# Altium project 4in1_ESC.PrjPcb
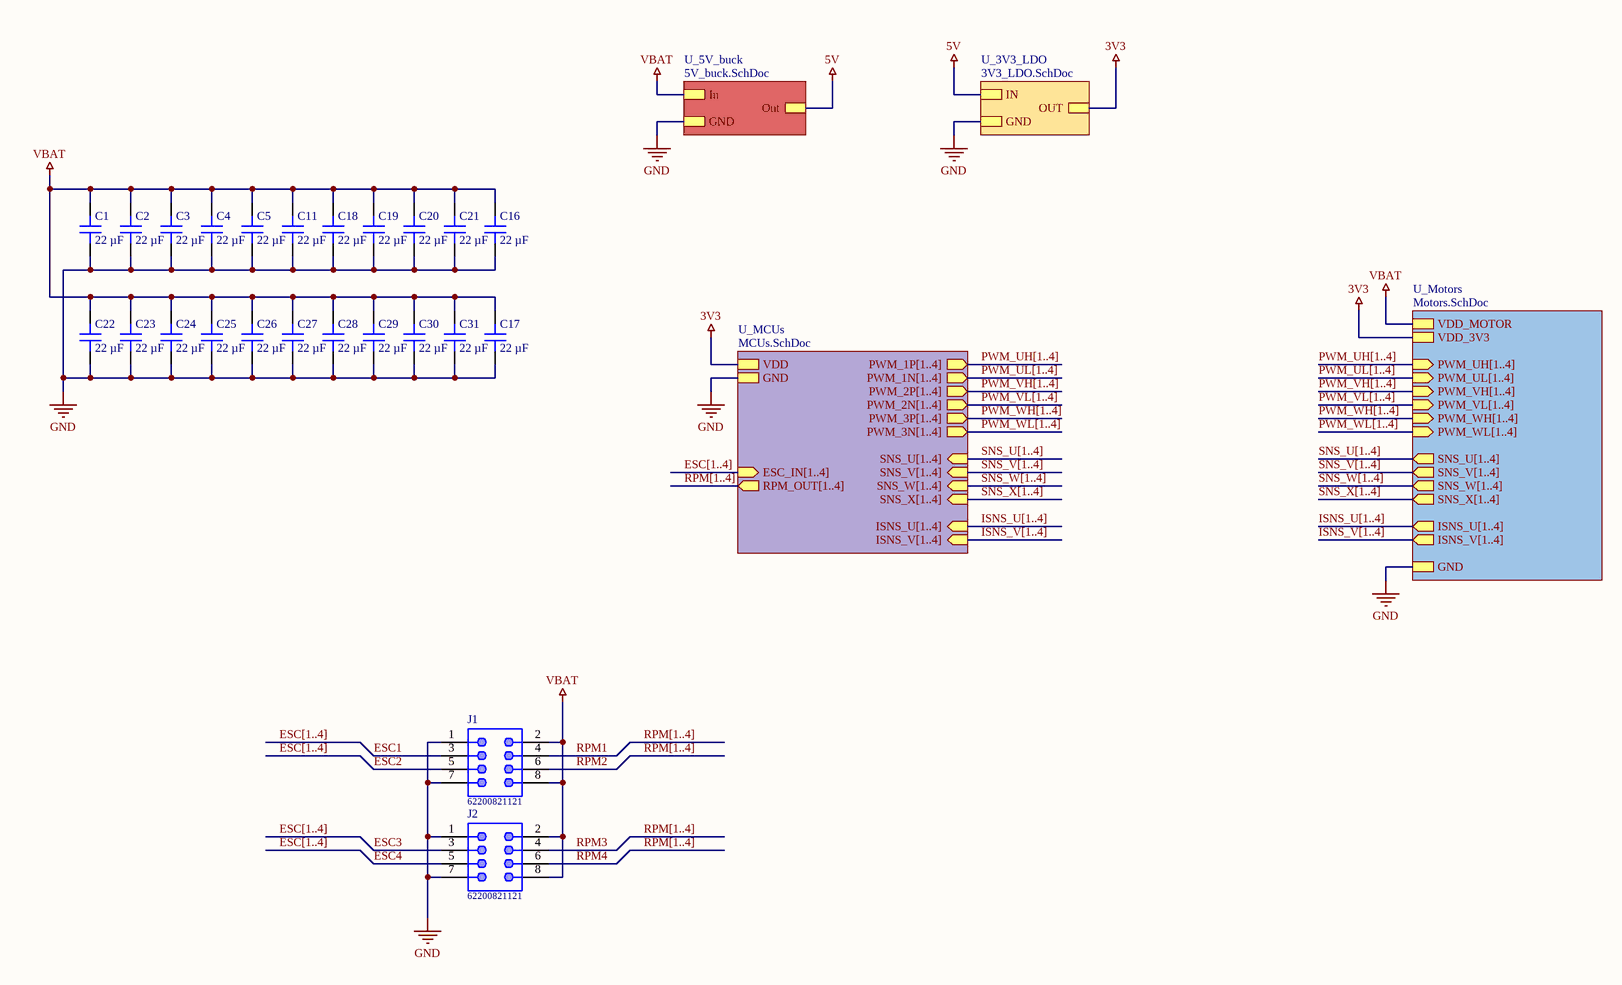
[diagram p0: Top.SchDoc]
7 sheets, 177 parts. Net scope: strictly hierarchical (ports join the sheet entries above them; power ports are local).
Board file: 4in1_ESC.PcbDoc
Sheets:
  Top.SchDoc
    U_5V_buck = 5V_buck.SchDoc
    U_3V3_LDO = 3V3_LDO.SchDoc
    U_Motors = Motors.SchDoc
      U_MOSFETs1 = MOSFETs.SchDoc
      U_MOSFETs2 = MOSFETs.SchDoc
      U_MOSFETs3 = MOSFETs.SchDoc
      U_MOSFETs4 = MOSFETs.SchDoc
      U_Half Bridge Driver_1 = Half_Bridge_Driver.SchDoc
      U_Half Bridge Driver_2 = Half_Bridge_Driver.SchDoc
      U_Half Bridge Driver_3 = Half_Bridge_Driver.SchDoc
      U_Half Bridge Driver_4 = Half_Bridge_Driver.SchDoc
    U_MCUs = MCUs.SchDoc

## Sheet Top.SchDoc
size B; SheetNumber: 1; SheetTotal: 8

### Parts
C1  22 µF  [CAP 0805_2012]
C2  22 µF  [CAP 0805_2012]
C3  22 µF  [CAP 0805_2012]
C4  22 µF  [CAP 0805_2012]
C5  22 µF  [CAP 0805_2012]
C11  22 µF  [CAP 0805_2012]
C16  22 µF  [CAP 0805_2012]
C17  22 µF  [CAP 0805_2012]
C18  22 µF  [CAP 0805_2012]
C19  22 µF  [CAP 0805_2012]
C20  22 µF  [CAP 0805_2012]
C21  22 µF  [CAP 0805_2012]
C22  22 µF  [CAP 0805_2012]
C23  22 µF  [CAP 0805_2012]
C24  22 µF  [CAP 0805_2012]
C25  22 µF  [CAP 0805_2012]
C26  22 µF  [CAP 0805_2012]
C27  22 µF  [CAP 0805_2012]
C28  22 µF  [CAP 0805_2012]
C29  22 µF  [CAP 0805_2012]
C30  22 µF  [CAP 0805_2012]
C31  22 µF  [CAP 0805_2012]
J1  62200821121  [62200821121]
J2  62200821121  [62200821121]

### Sub-sheets
U_3V3_LDO = 3V3_LDO.SchDoc: OUT, IN, GND
U_5V_buck = 5V_buck.SchDoc: Out, In, GND
U_MCUs = MCUs.SchDoc: VDD, GND, PWM_1P[1..4] (out), PWM_1N[1..4] (out), PWM_2P[1..4] (out), PWM_2N[1..4] (out), PWM_3P[1..4] (out), PWM_3N[1..4] (out), SNS_U[1..4] (in), SNS_V[1..4] (in), SNS_W[1..4] (in), SNS_X[1..4] (in), ISNS_U[1..4] (in), ISNS_V[1..4] (in), ESC_IN[1..4] (in), RPM_OUT[1..4] (out)
U_Motors = Motors.SchDoc: VDD_MOTOR, GND, PWM_UH[1..4] (in), PWM_UL[1..4] (in), PWM_VH[1..4] (in), PWM_VL[1..4] (in), PWM_WH[1..4] (in), PWM_WL[1..4] (in), SNS_U[1..4] (out), SNS_V[1..4] (out), SNS_W[1..4] (out), SNS_X[1..4] (out), VDD_3V3, ISNS_U[1..4] (out), ISNS_V[1..4] (out)

### Nets
3V3: sheet U_3V3_LDO/OUT, sheet U_Motors/VDD_3V3, sheet U_MCUs/VDD
5V: sheet U_5V_buck/Out, sheet U_3V3_LDO/IN
GND: C1.1 C2.1 C3.1 C4.1 C5.1 C11.1 C16.1 C17.1 C18.1 C19.1 C20.1 C21.1 C22.1 C23.1 C24.1 C25.1 C26.1 C27.1 C28.1 C29.1 C30.1 C31.1 J1.1 J1.7 J2.1 J2.7 ; sheet U_5V_buck/GND, sheet U_3V3_LDO/GND, sheet U_Motors/GND, sheet U_MCUs/GND
VBAT: C1.2 C2.2 C3.2 C4.2 C5.2 C11.2 C16.2 C17.2 C18.2 C19.2 C20.2 C21.2 C22.2 C23.2 C24.2 C25.2 C26.2 C27.2 C28.2 C29.2 C30.2 C31.2 J1.2 J1.8 J2.2 J2.8 ; sheet U_5V_buck/In, sheet U_Motors/VDD_MOTOR
ESC1: J1.3
ESC2: J1.5
ESC3: J2.3
ESC4: J2.5
RPM1: J1.4
RPM2: J1.6
RPM3: J2.4
RPM4: J2.6

### Buses and harness runs
bus ESC[1..4]
bus ESC[1..4] = sheet U_MCUs/ESC_IN[1..4]
bus ISNS_U[1..4] = sheet U_MCUs/ISNS_U[1..4]
bus ISNS_U[1..4] = sheet U_Motors/ISNS_U[1..4]
bus ISNS_V[1..4] = sheet U_MCUs/ISNS_V[1..4]
bus ISNS_V[1..4] = sheet U_Motors/ISNS_V[1..4]
bus PWM_UH[1..4] = sheet U_MCUs/PWM_1P[1..4]
bus PWM_UH[1..4] = sheet U_Motors/PWM_UH[1..4]
bus PWM_UL[1..4] = sheet U_MCUs/PWM_1N[1..4]
bus PWM_UL[1..4] = sheet U_Motors/PWM_UL[1..4]
bus PWM_VH[1..4] = sheet U_MCUs/PWM_2P[1..4]
bus PWM_VH[1..4] = sheet U_Motors/PWM_VH[1..4]
bus PWM_VL[1..4] = sheet U_MCUs/PWM_2N[1..4]
bus PWM_VL[1..4] = sheet U_Motors/PWM_VL[1..4]
bus PWM_WH[1..4] = sheet U_MCUs/PWM_3P[1..4]
bus PWM_WH[1..4] = sheet U_Motors/PWM_WH[1..4]
bus PWM_WL[1..4] = sheet U_MCUs/PWM_3N[1..4]
bus PWM_WL[1..4] = sheet U_Motors/PWM_WL[1..4]
bus RPM[1..4]
bus RPM[1..4] = sheet U_MCUs/RPM_OUT[1..4]
bus SNS_U[1..4] = sheet U_MCUs/SNS_U[1..4]
bus SNS_U[1..4] = sheet U_Motors/SNS_U[1..4]
bus SNS_V[1..4] = sheet U_MCUs/SNS_V[1..4]
bus SNS_V[1..4] = sheet U_Motors/SNS_V[1..4]
bus SNS_W[1..4] = sheet U_MCUs/SNS_W[1..4]
bus SNS_W[1..4] = sheet U_Motors/SNS_W[1..4]
bus SNS_X[1..4] = sheet U_MCUs/SNS_X[1..4]
bus SNS_X[1..4] = sheet U_Motors/SNS_X[1..4]

### Library data of the parts
C1-C5 C11 C16-C31 = CC0805MKX5R8BB226: CAP CER 22UF 25V X5R 0805; manufacturer: Yageo; Tolerance: ±20%; Part Number: CC0805MKX5R8BB226; Value: 22 µF; Applications: General Purpose; Capacitance: 22 µF; componentlink1description: Datasheet; componentlink1url: https://www.yageo.com/upload/media/product/productsearch/datasheet/mlcc/UPY-GPHC_X5R_4V-to-50V_25.pdf; componentlink2description: DigiKey Link; componentlink2url: https://www.digikey.com/en/products/detail/yageo/CC0805MKX5R8BB226/5195309; Device Package: 0805 (2012 Metric); Lifecycle Status: Active; Minimum Order: 1; Mounting Type: Surface Mount, MLCC; Operating Temperature: -55°C ~ 85°C; Package / Case: 0805 (2012 Metric); packaging: TapeAndReel; partid: 39226; Part Status: Active; price: 0.10; series: CC; Size / Dimension: 0.079" L x 0.049" W (2.00mm x 1.25mm); Supplier 1: DigiKey; Supplier Part Number 1: 311-1903-1-ND; Temperature Coefficient: X5R; Thickness (Max): 0.057" (1.45mm); Voltage - Rated: 25V
  C1-C5 C11 C16-C19 C21-C31: lastupdated: 8/21/2022 8:03:23 PM
  C20: lastupdated: 8/25/2022 6:52:09 AM
J1 J2 = 62200821121: WR-PHD Pin Header, THT, pitch 1.27mm, Dual Row, Vertical, 8p; Manufacturer: Wurth Elektronik; Pin Number: 8; Rated Current: 1A; Working Voltage: 100VAC; Withstanding Voltage: 500VAC; Contact Resistance: 20mOhm; System: Connector; ComponentLink1Description: Manufacturer; ComponentLink1URL: http://www.we-online.de; ComponentLink2Description: Datasheet; ComponentLink2URL: https://www.we-online.com/catalog/datasheet/62200821121.pdf; Manufacturer Part Number: 62200821121; Published Date: May 2020; Pitch: 1.27mm; Operating Temperature: -40 to +105degC; Mounting Technology: THT; Packaging: Box; Gender: Pin Header; Row Number: Dual; Orientation: Vertical

## Sheet 5V_buck.SchDoc
size A; SheetNumber: 3; SheetTotal: 8
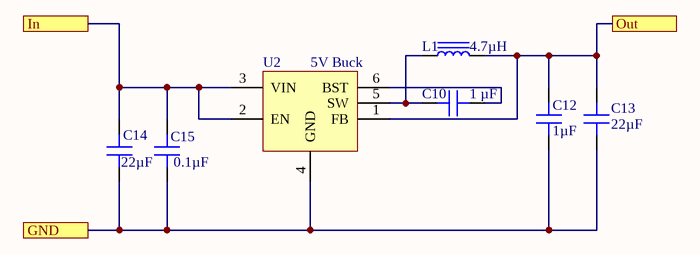
[diagram p1: 5V_buck.SchDoc]

### Parts
C10  1 µF  [CAP 0402_1005]
C12  1µF  [CAP 0603_1608]
C13  22µF  [CAP 0805_2012]
C14  22µF  [CAP 0805_2012]
C15  0.1µF  [CAP 0603_1608]
L1  4.7µH  [IND 1008_2520]
U2  5V Buck  [TSOT-26-6 - 3.2mm]

### Ports
GND, In, Out

### Nets
5V: C12.2 C13.2 L1.2 U2.1(FB) ; port Out
GND: C12.1 C13.1 C14.1 C15.2 U2.4(GND) ; port GND
VBAT: C14.2 C15.1 U2.2(EN) U2.3(VIN) ; port In
NetC10_1: C10.1 L1.1 U2.5(SW)
NetC10_2: C10.2 U2.6(BST)

### Library data of the parts
C10 = C0402C104K4RACAUTO: CAP CER 0.1UF 16V X7R 0402; manufacturer: KEMET; Capacitance: 0.1 µF; Tolerance: ±10%; Part Number: C0402C104K4RACAUTO; Value: 1 µF; Applications: Automotive, Bypass, Decoupling; componentlink1description: Datasheet; componentlink1url: https://api.kemet.com/component-edge/download/specsheet/C0402C104K4RACAUTO.pdf; componentlink2description: DigiKey Link; componentlink2url: https://www.digikey.com/en/products/detail/kemet/C0402C104K4RACAUTO/3314827; Device Package: 0402 (1005 Metric); lastupdated: 8/14/2022 9:05:51 PM; Lifecycle Status: Active; Minimum Order: 1; Mounting Type: Surface Mount, MLCC; Operating Temperature: -55°C ~ 125°C; Package / Case: 0402 (1005 Metric); packaging: TapeAndReel; partid: 3024; Part Status: Active; price: 0.01; Ratings: AEC-Q200; series: SMD Auto X7R; Size / Dimension: 0.039" L x 0.020" W (1.00mm x 0.50mm); Supplier 1: DigiKey; Supplier Part Number 1: 399-6828-1-ND; Temperature Coefficient: X7R; Thickness (Max): 0.022" (0.55mm); Voltage - Rated: 16V
C12 = GCJ188R71E105KA01D: CAP CER 1UF 25V X7R 0603; Manufacturer: Murata Electronics; Tolerance: ±10%; Part Number: GCJ188R71E105KA01D; Value: 1µF; Applications: Automotive, Boardflex Sensitive; Capacitance: 1µF; ComponentLink1Description: Datasheet; ComponentLink1URL: https://search.murata.co.jp/Ceramy/image/img/A01X/G101/ENG/GCJ188R71E105KA01-01.pdf; ComponentLink2Description: DigiKey Link; ComponentLink2URL: http://digikey.com/product-detail/en/murata-electronics/GCJ188R71E105KA01D/490-14409-1-ND/6606870; Device Package: 0603 (1608 Metric); Features: Soft Termination; LastUpdated: 13-Aug-20 10:24:06 AM; Lifecycle Status: Active; Minimum Order: 1; Mounting Type: Surface Mount, MLCC; Operating Temperature: -55°C ~ 125°C; Package / Case: 0603 (1608 Metric); Packaging: TapeAndReel; PartId: 9566; Part Status: Active; Price: 0.05; Ratings: AEC-Q200; Series: GCJ; Size / Dimension: 0.063" L x 0.031" W (1.60mm x 0.80mm); Supplier 1: DigiKey; Supplier Part Number 1: 490-14409-1-ND; Temperature Coefficient: X7R; Thickness (Max): 0.035" (0.90mm)
C13 = CL21A226MOQNNNE: CAP CER 22UF 16V X5R 0805; Manufacturer: Samsung Electro-Mechanics; Tolerance: ±20%; Part Number: CL21A226MOQNNNE; Value: 22µF; Applications: General Purpose; Capacitance: 22µF; ComponentLink1Description: Datasheet; ComponentLink1URL: http://www.samsungsem.com/kr/support/product-search/mlcc/CL21A226MOQNNNE.jsp; ComponentLink2Description: DigiKey Link; ComponentLink2URL: http://digikey.com/product-detail/en/samsung-electro-mechanics/CL21A226MOQNNNE/1276-2909-1-ND/3890995; Device Package: 0805 (2012 Metric); LastUpdated: 21-Jan-20 12:03:05 AM; Lifecycle Status: Active; Minimum Order: 1; Mounting Type: Surface Mount, MLCC; Operating Temperature: -55°C ~ 85°C; Package / Case: 0805 (2012 Metric); Packaging: TapeAndReel; PartId: 3052; Part Status: Active; Price: 0.11; Series: CL; Size / Dimension: 0.079" L x 0.049" W (2.00mm x 1.25mm); Supplier 1: DigiKey; Supplier Part Number 1: 1276-2909-1-ND; Temperature Coefficient: X5R; Thickness (Max): 0.055" (1.40mm); Voltage - Rated: 16V
C14 = C2012X7S1E106K125AC: CAP CER 10UF 25V X7S 0805; Manufacturer: TDK Corporation; Capacitance: 10µF; Tolerance: ±10%; Part Number: C2012X7S1E106K125AC; Value: 22µF; Applications: General Purpose; ComponentLink1Description: Datasheet; ComponentLink1URL: https://product.tdk.com/en/search/capacitor/ceramic/mlcc/info?part_no=C2012X7S1E106K125AC?ref_disty=digikey; ComponentLink2Description: DigiKey Link; ComponentLink2URL: http://digikey.com/product-detail/en/tdk-corporation/C2012X7S1E106K125AC/445-181600-1-ND/9991478; Device Package: 0805 (2012 Metric); Features: Low ESL; LastUpdated: 21-Jan-20 12:03:04 AM; Lifecycle Status: Active; Minimum Order: 1; Mounting Type: Surface Mount, MLCC; Operating Temperature: -55°C ~ 125°C; Package / Case: 0805 (2012 Metric); Packaging: TapeAndReel; PartId: 3339; Part Status: Active; Price: 0.15; Series: C; Size / Dimension: 0.079" L x 0.049" W (2.00mm x 1.25mm); Supplier 1: DigiKey; Supplier Part Number 1: 445-181600-1-ND; Temperature Coefficient: X7S; Thickness (Max): 0.057" (1.45mm); Voltage - Rated: 25V
C15 = GCG188R92A104KA03D: CAP CER 0.1UF 100V 0603 EPOXY; Manufacturer: Murata Electronics; Temperature Coefficient: X8R; Tolerance: ±10%; Part Number: GCG188R92A104KA03D; Value: 0.1µF; Applications: Automotive; Capacitance: 0.1µF; ComponentLink1Description: Datasheet; ComponentLink1URL: https://search.murata.co.jp/Ceramy/image/img/A01X/G101/ENG/GCG188R92A104KA03-01.pdf; ComponentLink2Description: DigiKey Link; ComponentLink2URL: http://digikey.com/product-detail/en/murata-electronics/GCG188R92A104KA03D/490-18197-1-ND/9867926; Device Package: 0603 (1608 Metric); Features: Epoxy Mountable; LastUpdated: 21-Jan-20 12:01:59 AM; Lifecycle Status: Active; Minimum Order: 1; Mounting Type: Surface Mount, MLCC, Epoxy; Operating Temperature: -55°C ~ 150°C; Package / Case: 0603 (1608 Metric); Packaging: TapeAndReel; PartId: 9025; Part Status: Active; Price: 0.07; Ratings: AEC-Q200; Series: GCG; Size / Dimension: 0.063" L x 0.031" W (1.60mm x 0.80mm); Supplier 1: DigiKey; Supplier Part Number 1: 490-18197-1-ND; Thickness (Max): 0.035" (0.90mm); Voltage - Rated: 100V
L1 = MLP2520S4R7ST0S1: FIXED IND 4.7UH 1A 110 MOHM SMD; Manufacturer: TDK Corporation; DC Resistance (DCR): 143mOhm Max; Inductance Frequency - Test: 2MHz; Material - Core: Ferrite; Shielding: Shielded; Tolerance: ±20%; Type: Multilayer; Part Number: MLP2520S4R7ST0S1; ComponentLink1Description: Datasheet; ComponentLink1URL: https://product.tdk.com/info/en/catalog/datasheets/inductor_commercial_power_mlp2520_en.pdf?ref_disty=digikey; ComponentLink2Description: DigiKey Link; ComponentLink2URL: http://digikey.com/product-detail/en/tdk-corporation/MLP2520S4R7ST0S1/445-6378-1-ND/2465705; Current Rating (Amps): 1A; Device Package: 1008 (2520 Metric); Height - Seated (Max): 0.039" (1.00mm); Inductance: 4.7µH; LastUpdated: 13-Aug-20 11:03:40 AM; Lifecycle Status: Active; Minimum Order: 1; Mounting Type: Surface Mount; Operating Temperature: -40°C ~ 125°C; Package / Case: 1008 (2520 Metric); Packaging: TapeAndReel; PartId: 3467; Part Status: Active; Price: 0.14; Series: MLP; Size / Dimension: 0.098" L x 0.079" W (2.50mm x 2.00mm); Supplier 1: DigiKey; Supplier Part Number 1: 445-6378-1-ND; Supplier Device Package: 1008 (2520 Metric); Value: 4.7µH
U2 = AP63205WU-7: 5V fixed step down Buck

## Sheet 3V3_LDO.SchDoc
size A; SheetNumber: 2; SheetTotal: 7
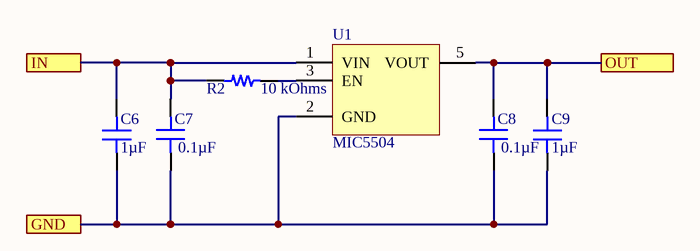
[diagram p2: 3V3_LDO.SchDoc]

### Parts
C6  1µF  [CAP 0603_1608]
C7  0.1µF  [CAP 0603_1608]
C8  0.1µF  [CAP 0603_1608]
C9  1µF  [CAP 0603_1608]
R2  10 kOhms  [RES 0603_1608]
U1  MIC5504  [TI SOT-23-5 DBV]

### Ports
GND, IN, OUT

### Nets
3V3: C8.1 C9.2 U1.5(VOUT) ; port OUT
5V: C6.2 C7.1 R2.2 U1.1(VIN) ; port IN
GND: C6.1 C7.2 C8.2 C9.1 U1.2(GND) ; port GND
NetR2_1: R2.1 U1.3(EN)

### Library data of the parts
C6 C9 = GCJ188R71E105KA01D: as C12 on sheet 5V_buck; Part Number: GCJ188R71E105KA01D; Value: 1µF; Applications: Automotive, Boardflex Sensitive; Capacitance: 1µF; ComponentLink1Description: Datasheet; ComponentLink1URL: https://search.murata.co.jp/Ceramy/image/img/A01X/G101/ENG/GCJ188R71E105KA01-01.pdf; ComponentLink2Description: DigiKey Link; ComponentLink2URL: http://digikey.com/product-detail/en/murata-electronics/GCJ188R71E105KA01D/490-14409-1-ND/6606870; Device Package: 0603 (1608 Metric); Features: Soft Termination; LastUpdated: 13-Aug-20 10:24:06 AM; Lifecycle Status: Active; Minimum Order: 1; Mounting Type: Surface Mount, MLCC; Operating Temperature: -55°C ~ 125°C; Package / Case: 0603 (1608 Metric); Packaging: TapeAndReel; PartId: 9566; Part Status: Active; Price: 0.05; Ratings: AEC-Q200; Series: GCJ; Size / Dimension: 0.063" L x 0.031" W (1.60mm x 0.80mm); Supplier 1: DigiKey; Supplier Part Number 1: 490-14409-1-ND; Temperature Coefficient: X7R; Thickness (Max): 0.035" (0.90mm)
C7 C8 = GCG188R92A104KA03D: as C15 on sheet 5V_buck; Part Number: GCG188R92A104KA03D; Value: 0.1µF; Applications: Automotive; Capacitance: 0.1µF; ComponentLink1Description: Datasheet; ComponentLink1URL: https://search.murata.co.jp/Ceramy/image/img/A01X/G101/ENG/GCG188R92A104KA03-01.pdf; ComponentLink2Description: DigiKey Link; ComponentLink2URL: http://digikey.com/product-detail/en/murata-electronics/GCG188R92A104KA03D/490-18197-1-ND/9867926; Device Package: 0603 (1608 Metric); Features: Epoxy Mountable; LastUpdated: 21-Jan-20 12:01:59 AM; Lifecycle Status: Active; Minimum Order: 1; Mounting Type: Surface Mount, MLCC, Epoxy; Operating Temperature: -55°C ~ 150°C; Package / Case: 0603 (1608 Metric); Packaging: TapeAndReel; PartId: 9025; Part Status: Active; Price: 0.07; Ratings: AEC-Q200; Series: GCG; Size / Dimension: 0.063" L x 0.031" W (1.60mm x 0.80mm); Supplier 1: DigiKey; Supplier Part Number 1: 490-18197-1-ND; Thickness (Max): 0.035" (0.90mm); Voltage - Rated: 100V
R2 = RNCS0603BKE10K0: RES 10K OHM 0.1% 1/16W 0603; Manufacturer: Stackpole Electronics Inc; Power (Watts): 0.063W, 1/16W; Temperature Coefficient: ±25ppm/°C; Part Number: RNCS0603BKE10K0; Value: 10 kOhms; ComponentLink1Description: Datasheet; ComponentLink1URL: https://www.seielect.com/catalog/sei-rncs_rnch.pdf; ComponentLink2Description: DigiKey Link; ComponentLink2URL: http://digikey.com/product-detail/en/stackpole-electronics-inc/RNCS0603BKE10K0/RNCS0603BKE10K0CT-ND/1800113; Composition: Thin Film; Device Package: 0603 (1608 Metric); Features: Anti-Corrosive, Automotive AEC-Q200, Moisture Resistant; Height - Seated (Max): 0.022" (0.55mm); LastUpdated: 21-Jan-20 12:25:01 AM; Lifecycle Status: Active; Minimum Order: 1; Number of Terminations: 2; Operating Temperature: -55°C ~ 155°C; Package / Case: 0603 (1608 Metric); Packaging: TapeAndReel; PartId: 4838; Part Status: Active; Price: 0.08; Ratings: AEC-Q200; Resistance: 10 kOhms; Series: RNCS; Size / Dimension: 0.061" L x 0.031" W (1.55mm x 0.80mm); Supplier 1: DigiKey; Supplier Part Number 1: RNCS0603BKE10K0CT-ND; Supplier Device Package: 0603; Tolerance: ±0.1%
U1 = MIC5504-3.3YM5: 3.3V LDO

## Sheet Motors.SchDoc
size B; SheetNumber: 5; SheetTotal: 8
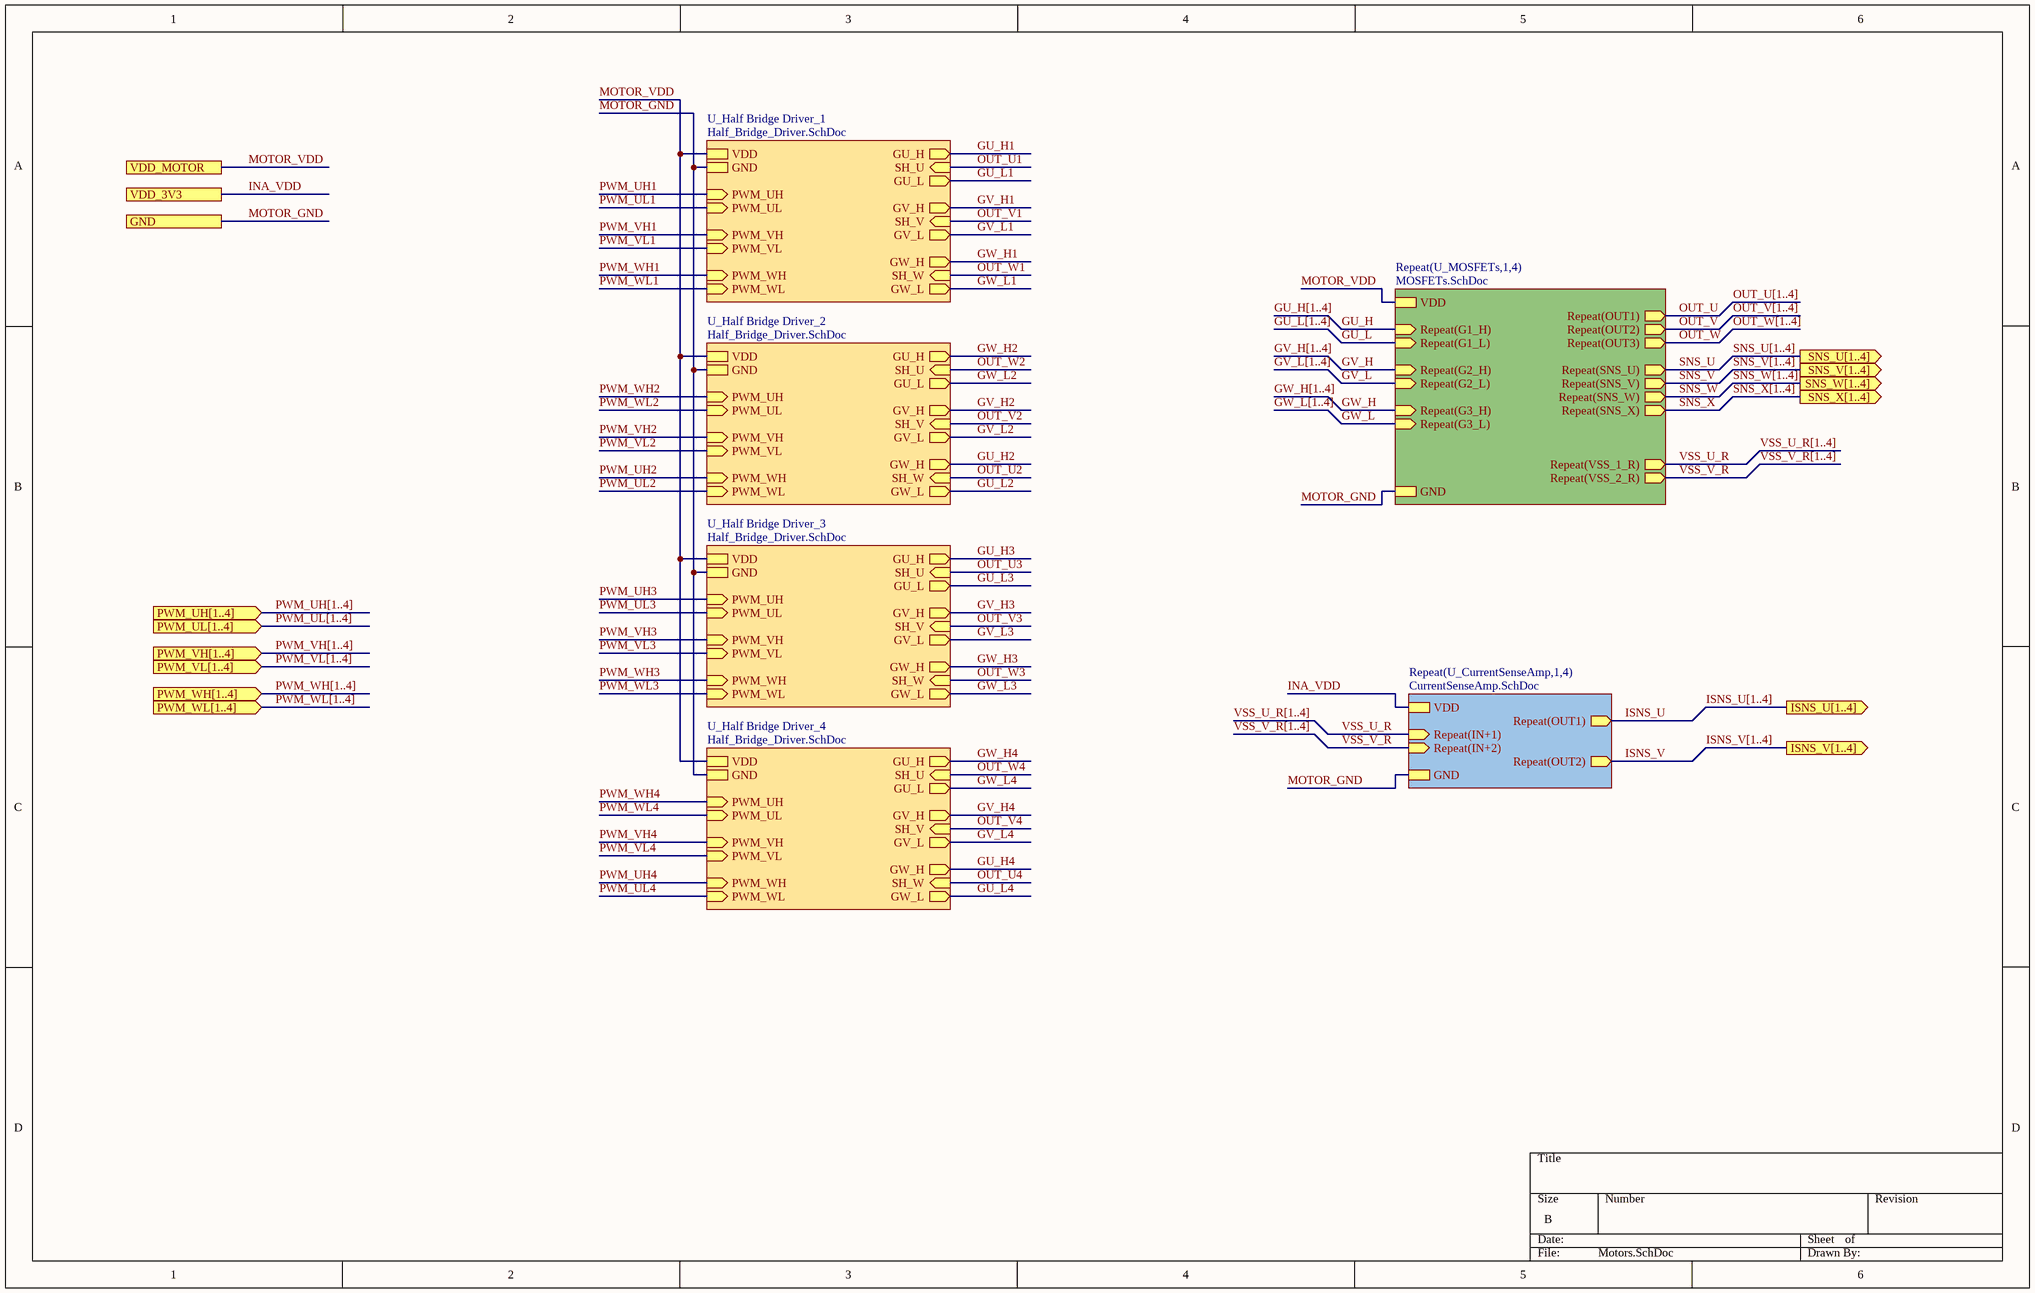
[diagram p3: Motors.SchDoc]

### Sub-sheets
Repeat(U_CurrentSenseAmp,1,4) = CurrentSenseAmp.SchDoc (file not in this document): VDD, GND, Repeat(IN+1) (in), Repeat(IN+2) (in), Repeat(OUT1) (out), Repeat(OUT2) (out)
Repeat(U_MOSFETs,1,4) = MOSFETs.SchDoc: Repeat(G2_H) (in), Repeat(G2_L) (in), Repeat(G1_L) (in), Repeat(G1_H) (in), Repeat(G3_H) (in), Repeat(G3_L) (in), Repeat(OUT1) (out), Repeat(OUT2) (out), Repeat(OUT3) (out), VDD, GND, Repeat(SNS_U) (out), Repeat(SNS_V) (out), Repeat(SNS_W) (out), Repeat(SNS_X) (out), Repeat(VSS_1_R) (out), Repeat(VSS_2_R) (out)
U_Half Bridge Driver_1 = Half_Bridge_Driver.SchDoc: VDD, GND, PWM_UH (in), PWM_UL (in), PWM_VH (in), PWM_VL (in), PWM_WH (in), PWM_WL (in), GU_H (out), GU_L (out), SH_U (in), GV_H (out), GV_L (out), SH_V (in), GW_H (out), GW_L (out), SH_W (in)
U_Half Bridge Driver_2 = Half_Bridge_Driver.SchDoc: VDD, GND, PWM_UH (in), PWM_UL (in), PWM_VH (in), PWM_VL (in), PWM_WH (in), PWM_WL (in), GU_H (out), GU_L (out), SH_U (in), GV_H (out), GV_L (out), SH_V (in), GW_H (out), GW_L (out), SH_W (in)
U_Half Bridge Driver_3 = Half_Bridge_Driver.SchDoc: VDD, GND, PWM_UH (in), PWM_UL (in), PWM_VH (in), PWM_VL (in), PWM_WH (in), PWM_WL (in), GU_H (out), GU_L (out), SH_U (in), GV_H (out), GV_L (out), SH_V (in), GW_H (out), GW_L (out), SH_W (in)
U_Half Bridge Driver_4 = Half_Bridge_Driver.SchDoc: VDD, GND, PWM_UH (in), PWM_UL (in), PWM_VH (in), PWM_VL (in), PWM_WH (in), PWM_WL (in), GU_H (out), GU_L (out), SH_U (in), GV_H (out), GV_L (out), SH_V (in), GW_H (out), GW_L (out), SH_W (in)

### Ports
GND, ISNS_U[1..4] (out), ISNS_V[1..4] (out), PWM_UH[1..4] (in), PWM_UL[1..4] (in), PWM_VH[1..4] (in), PWM_VL[1..4] (in), PWM_WH[1..4] (in), PWM_WL[1..4] (in), SNS_U[1..4] (out), SNS_V[1..4] (out), SNS_W[1..4] (out), SNS_X[1..4] (out), VDD_3V3, VDD_MOTOR

### Nets
INA_VDD: port VDD_3V3, sheet Repeat(U_CurrentSenseAmp,1,4)/VDD  [project net 3V3]
MOTOR_GND: port GND, sheet Repeat(U_MOSFETs,1,4)/GND, sheet U_Half Bridge Driver_1/GND, sheet U_Half Bridge Driver_2/GND, sheet U_Half Bridge Driver_3/GND, sheet U_Half Bridge Driver_4/GND, sheet Repeat(U_CurrentSenseAmp,1,4)/GND  [project net GND]
MOTOR_VDD: port VDD_MOTOR, sheet Repeat(U_MOSFETs,1,4)/VDD, sheet U_Half Bridge Driver_1/VDD, sheet U_Half Bridge Driver_2/VDD, sheet U_Half Bridge Driver_3/VDD, sheet U_Half Bridge Driver_4/VDD  [project net VBAT]
GU_H: sheet Repeat(U_MOSFETs,1,4)/Repeat(G1_H)
GU_L: sheet Repeat(U_MOSFETs,1,4)/Repeat(G1_L)
GV_H: sheet Repeat(U_MOSFETs,1,4)/Repeat(G2_H)
GV_L: sheet Repeat(U_MOSFETs,1,4)/Repeat(G2_L)
GW_H: sheet Repeat(U_MOSFETs,1,4)/Repeat(G3_H)
GW_L: sheet Repeat(U_MOSFETs,1,4)/Repeat(G3_L)
ISNS_U: sheet Repeat(U_CurrentSenseAmp,1,4)/Repeat(OUT1)
ISNS_V: sheet Repeat(U_CurrentSenseAmp,1,4)/Repeat(OUT2)
OUT_U: sheet Repeat(U_MOSFETs,1,4)/Repeat(OUT1)
OUT_V: sheet Repeat(U_MOSFETs,1,4)/Repeat(OUT2)
OUT_W: sheet Repeat(U_MOSFETs,1,4)/Repeat(OUT3)
SNS_U: sheet Repeat(U_MOSFETs,1,4)/Repeat(SNS_U)
SNS_V: sheet Repeat(U_MOSFETs,1,4)/Repeat(SNS_V)
SNS_W: sheet Repeat(U_MOSFETs,1,4)/Repeat(SNS_W)
SNS_X: sheet Repeat(U_MOSFETs,1,4)/Repeat(SNS_X)
VSS_U_R: sheet Repeat(U_MOSFETs,1,4)/Repeat(VSS_1_R), sheet Repeat(U_CurrentSenseAmp,1,4)/Repeat(IN+1)
VSS_V_R: sheet Repeat(U_MOSFETs,1,4)/Repeat(VSS_2_R), sheet Repeat(U_CurrentSenseAmp,1,4)/Repeat(IN+2)

### Buses and harness runs
bus GU_H[1..4]
bus GU_L[1..4]
bus GV_H[1..4]
bus GV_L[1..4]
bus GW_H[1..4]
bus GW_L[1..4]
bus ISNS_U[1..4] = port ISNS_U[1..4]
bus ISNS_V[1..4] = port ISNS_V[1..4]
bus OUT_U[1..4]
bus OUT_V[1..4]
bus OUT_W[1..4]
bus PWM_UH[1..4] = port PWM_UH[1..4]
bus PWM_UL[1..4] = port PWM_UL[1..4]
bus PWM_VH[1..4] = port PWM_VH[1..4]
bus PWM_VL[1..4] = port PWM_VL[1..4]
bus PWM_WH[1..4] = port PWM_WH[1..4]
bus PWM_WL[1..4] = port PWM_WL[1..4]
bus SNS_U[1..4] = port SNS_U[1..4]
bus SNS_V[1..4] = port SNS_V[1..4]
bus SNS_W[1..4] = port SNS_W[1..4]
bus SNS_X[1..4] = port SNS_X[1..4]
bus VSS_U_R[1..4]
bus VSS_V_R[1..4]

## Sheet MOSFETs.SchDoc
size A; SheetNumber: 6; SheetTotal: 8
Used 4 times, as channels U_Motors/U_MOSFETs1, U_Motors/U_MOSFETs2, U_Motors/U_MOSFETs3, U_Motors/U_MOSFETs4. Parts and nets are listed once, with the designators drawn on the sheet.
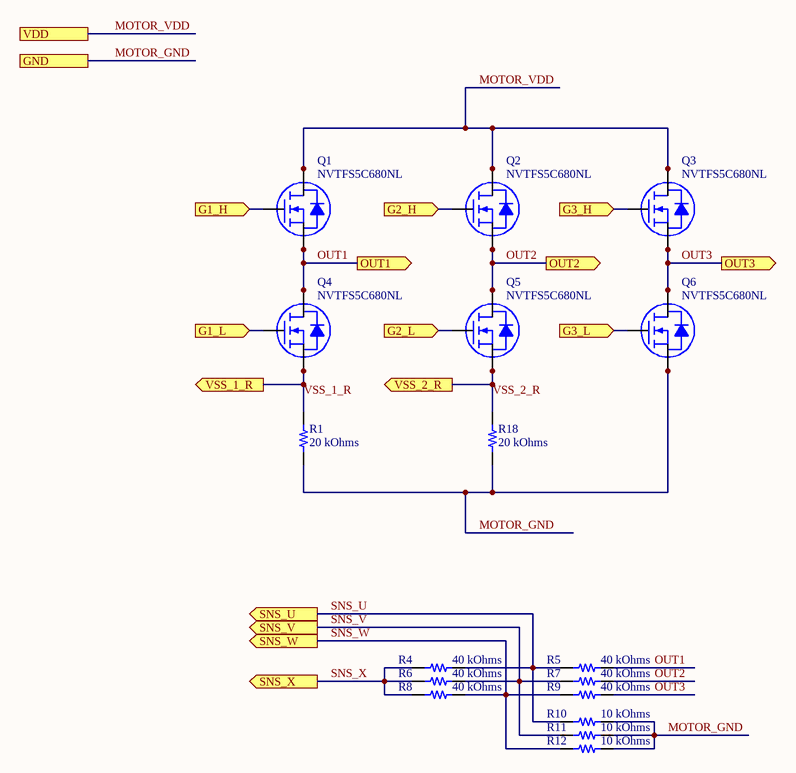
[diagram p4: MOSFETs.SchDoc]

### Parts
Q1  NVTFS5C680NL  [NVTFS015N04CTAG]
Q2  NVTFS5C680NL  [NVTFS015N04CTAG]
Q3  NVTFS5C680NL  [NVTFS015N04CTAG]
Q4  NVTFS5C680NL  [NVTFS015N04CTAG]
Q5  NVTFS5C680NL  [NVTFS015N04CTAG]
Q6  NVTFS5C680NL  [NVTFS015N04CTAG]
R1  20 kOhms  [RES 0805_2012]
R4  40 kOhms  [RES 0402_1005]
R5  40 kOhms  [RES 0402_1005]
R6  40 kOhms  [RES 0402_1005]
R7  40 kOhms  [RES 0402_1005]
R8  40 kOhms  [RES 0402_1005]
R9  40 kOhms  [RES 0402_1005]
R10  10 kOhms  [RES 0402_1005]
R11  10 kOhms  [RES 0402_1005]
R12  10 kOhms  [RES 0402_1005]
R18  20 kOhms  [RES 0805_2012]

### Ports
G1_H (in), G1_L (in), G2_H (in), G2_L (in), G3_H (in), G3_L (in), GND, OUT1 (out), OUT2 (out), OUT3 (out), SNS_U (out), SNS_V (out), SNS_W (out), SNS_X (out), VDD, VSS_1_R (out), VSS_2_R (out)

### Nets
G1_H: Q1.4(G) ; port G1_H
G1_L: Q4.4(G) ; port G1_L
G2_H: Q2.4(G) ; port G2_H
G2_L: Q5.4(G) ; port G2_L
G3_H: Q3.4(G) ; port G3_H
G3_L: Q6.4(G) ; port G3_L
MOTOR_GND: Q6.1(S) Q6.2(S) Q6.3(S) R1.1 R10.1 R11.1 R12.1 R18.1 ; port GND
MOTOR_VDD: Q1.5(D) Q1.6(D) Q1.7(D) Q1.8(D) Q2.5(D) Q2.6(D) Q2.7(D) Q2.8(D) Q3.5(D) Q3.6(D) Q3.7(D) Q3.8(D) ; port VDD
OUT1: Q1.1(S) Q1.2(S) Q1.3(S) Q4.5(D) Q4.6(D) Q4.7(D) Q4.8(D) R5.2 ; port OUT1
OUT2: Q2.1(S) Q2.2(S) Q2.3(S) Q5.5(D) Q5.6(D) Q5.7(D) Q5.8(D) R7.2 ; port OUT2
OUT3: Q3.1(S) Q3.2(S) Q3.3(S) Q6.5(D) Q6.6(D) Q6.7(D) Q6.8(D) R9.2 ; port OUT3
SNS_U: R4.2 R5.1 R10.2 ; port SNS_U
SNS_V: R6.2 R7.1 R11.2 ; port SNS_V
SNS_W: R8.2 R9.1 R12.2 ; port SNS_W
SNS_X: R4.1 R6.1 R8.1 ; port SNS_X
VSS_1_R: Q4.1(S) Q4.2(S) Q4.3(S) R1.2 ; port VSS_1_R
VSS_2_R: Q5.1(S) Q5.2(S) Q5.3(S) R18.2 ; port VSS_2_R

### Channels
U_Motors/U_MOSFETs1: designators end in _1; ports G1_H=GU_H G1_L=GU_L G2_H=GV_H G2_L=GV_L G3_H=GW_H G3_L=GW_L GND=GND OUT1=OUT1 OUT2=OUT2 OUT3=OUT3 SNS_U=SNS_U SNS_V=SNS_V SNS_W=SNS_W SNS_X=SNS_X VDD=VBAT VSS_1_R=VSS_1_R_U_MOSFETs1 VSS_2_R=VSS_2_R_U_MOSFETs1
U_Motors/U_MOSFETs2: designators end in _2; ports G1_H=GU_H2 G1_L=GU_L2 G2_H=GV_H G2_L=GV_L G3_H=GU_H G3_L=GU_L GND=GND OUT1=OUT1 OUT2=OUT2 OUT3=OUT3 SNS_U=SNS_U SNS_V=SNS_V SNS_W=SNS_W SNS_X=SNS_X VDD=VBAT VSS_1_R=VSS_1_R_U_MOSFETs2 VSS_2_R=VSS_2_R_U_MOSFETs2
U_Motors/U_MOSFETs3: designators end in _3; ports G1_H=GU_H G1_L=GU_L G2_H=GV_H G2_L=GV_L G3_H=GW_H G3_L=GW_L GND=GND OUT1=OUT1 OUT2=OUT2 OUT3=OUT3 SNS_U=SNS_U SNS_V=SNS_V SNS_W=SNS_W SNS_X=SNS_X VDD=VBAT VSS_1_R=VSS_1_R_U_MOSFETs3 VSS_2_R=VSS_2_R_U_MOSFETs3
U_Motors/U_MOSFETs4: designators end in _4; ports G1_H=GU_H4 G1_L=GU_L4 G2_H=GV_H G2_L=GV_L G3_H=GU_H G3_L=GU_L GND=GND OUT1=OUT1 OUT2=OUT2 OUT3=OUT3 SNS_U=SNS_U SNS_V=SNS_V SNS_W=SNS_W SNS_X=SNS_X VDD=VBAT VSS_1_R=VSS_1_R_U_MOSFETs4 VSS_2_R=VSS_2_R_U_MOSFETs4

### Library data of the parts
Q1-Q6 = NVTFS5C680NL: N-FET
R1 R18 = PCAN0805E2002BST5: RES SMD 20K OHM 0.1% 1W 0805; Manufacturer: Vishay Thin Film; Temperature Coefficient: ±25ppm/°C; Part Number: PCAN0805E2002BST5; Value: 20 kOhms; ComponentLink1Description: Datasheet; ComponentLink1URL: http://www.vishay.com/docs/60125/pcan.pdf; ComponentLink2Description: DigiKey Link; ComponentLink2URL: http://digikey.com/product-detail/en/vishay-thin-film/PCAN0805E2002BST5/764-1242-1-ND/6003316; Composition: Thin Film; Device Package: 0805 (2012 Metric); Features: Flame Proof, Moisture Resistant, Safety; Height - Seated (Max): 0.018" (0.46mm); LastUpdated: 8/26/2022 12:02:22 PM; Lifecycle Status: Active; Minimum Order: 1; Number of Terminations: 2; Operating Temperature: -55°C ~ 155°C; Package / Case: 0805 (2012 Metric); Packaging: TapeAndReel; PartId: 32096; Part Status: Active; Power (Watts): 1W; Price: 0.59; Resistance: 20 kOhms; Series: PCAN; Size / Dimension: 0.080" L x 0.050" W (2.03mm x 1.27mm); Supplier 1: DigiKey; Supplier Part Number 1: 764-1242-1-ND; Supplier Device Package: 0805; Tolerance: ±0.1%
R4-R12 = RK73H1ETTP1432F: RES 14.3K OHM 1% 1/10W 0402; Manufacturer: KOA Speer Electronics, Inc.; Power (Watts): 0.1W, 1/10W; Resistance: 14.3 kOhms; Temperature Coefficient: ±100ppm/°C; Part Number: RK73H1ETTP1432F; ComponentLink1Description: Datasheet; ComponentLink1URL: http://www.koaspeer.com/catimages/Products/RK73H/RK73H.pdf; ComponentLink2Description: DigiKey Link; ComponentLink2URL: https://www.digikey.com/en/products/detail/koa-speer-electronics-inc/RK73H1ETTP1432F/9844351; Composition: Thick Film; Device Package: 0402 (1005 Metric); Features: Automotive AEC-Q200, Moisture Resistant; Height - Seated (Max): 0.016" (0.40mm); LastUpdated: 8/14/2022 9:23:49 PM; Lifecycle Status: Active; Minimum Order: 1; Number of Terminations: 2; Operating Temperature: -55°C ~ 155°C; Package / Case: 0402 (1005 Metric); Packaging: CutTape; PartId: 10193; Part Status: Active; Price: 0.01; Ratings: AEC-Q200; Series: RK73H; Size / Dimension: 0.039" L x 0.020" W (1.00mm x 0.50mm); Supplier 1: DigiKey; Supplier Part Number 1: 2019-RK73H1ETTP1432FCT-ND; Supplier Device Package: 0402; Tolerance: ±1%
  R4-R9: Value: 40 kOhms
  R10-R12: Value: 10 kOhms

## Sheet Half_Bridge_Driver.SchDoc
size A; SheetNumber: 6; SheetTotal: 8
Used 4 times, as channels U_Motors/U_Half Bridge Driver_1, U_Motors/U_Half Bridge Driver_2, U_Motors/U_Half Bridge Driver_3, U_Motors/U_Half Bridge Driver_4. Parts and nets are listed once, with the designators drawn on the sheet.
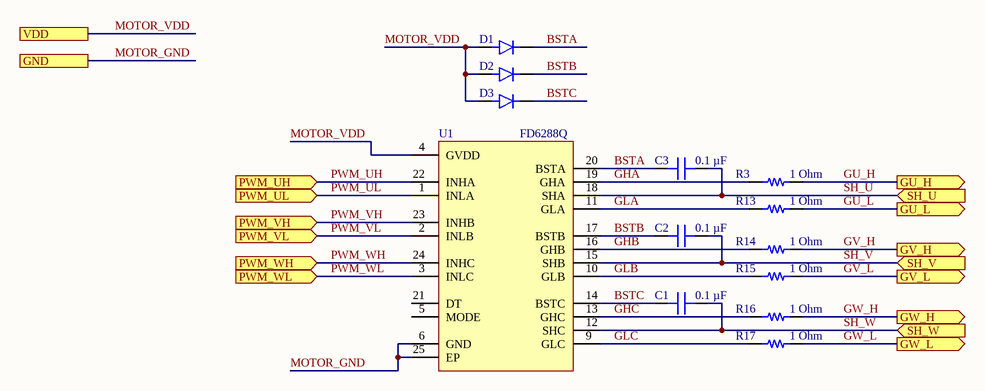
[diagram p5: Half_Bridge_Driver.SchDoc]

### Parts
C1  0.1 µF  [CAP 0402_1005]
C2  0.1 µF  [CAP 0402_1005]
C3  0.1 µF  [CAP 0402_1005]
D1  Diode  [Diode DFN1608D-2 (SOD1608)]  (value not drawn)
D2  Diode  [Diode DFN1608D-2 (SOD1608)]  (value not drawn)
D3  Diode  [Diode DFN1608D-2 (SOD1608)]  (value not drawn)
R3  1 Ohm  [RES 0402_1005]
R13  1 Ohm  [RES 0402_1005]
R14  1 Ohm  [RES 0402_1005]
R15  1 Ohm  [RES 0402_1005]
R16  1 Ohm  [RES 0402_1005]
R17  1 Ohm  [RES 0402_1005]
U1  FD6288Q  [QFN50P400X400X100-25N]

### Ports
GND, GU_H (out), GU_L (out), GV_H (out), GV_L (out), GW_H (out), GW_L (out), PWM_UH (in), PWM_UL (in), PWM_VH (in), PWM_VL (in), PWM_WH (in), PWM_WL (in), SH_U (in), SH_V (in), SH_W (in), VDD

### Nets
BSTA: C3.1 D1.1(A) U1.20(BSTA)
BSTB: C2.1 D2.1(A) U1.17(BSTB)
BSTC: C1.1 D3.1(A) U1.14(BSTC)
GHA: R3.1 U1.19(GHA)
GHB: R14.1 U1.16(GHB)
GHC: R16.1 U1.13(GHC)
GLA: R13.1 U1.11(GLA)
GLB: R15.1 U1.10(GLB)
GLC: R17.1 U1.9(GLC)
GU_H: R3.2 ; port GU_H
GU_L: R13.2 ; port GU_L
GV_H: R14.2 ; port GV_H
GV_L: R15.2 ; port GV_L
GW_H: R16.2 ; port GW_H
GW_L: R17.2 ; port GW_L
MOTOR_GND: U1.6(GND) U1.25(EP) ; port GND
MOTOR_VDD: D1.2(BLUE(C)) D2.2(BLUE(C)) D3.2(BLUE(C)) U1.4(GVDD) ; port VDD
PWM_UH: U1.22(INHA) ; port PWM_UH
PWM_UL: U1.1(INLA) ; port PWM_UL
PWM_VH: U1.23(INHB) ; port PWM_VH
PWM_VL: U1.2(INLB) ; port PWM_VL
PWM_WH: U1.24(INHC) ; port PWM_WH
PWM_WL: U1.3(INLC) ; port PWM_WL
SH_U: C3.2 U1.18(SHA) ; port SH_U
SH_V: C2.2 U1.15(SHB) ; port SH_V
SH_W: C1.2 U1.12(SHC) ; port SH_W

Not connected (* = marked no-connect by the designer): U1 5(MODE) 21(DT)

### Channels
U_Motors/U_Half Bridge Driver_1: designators end in _1; ports GND=GND GU_H=GU_H GU_L=GU_L GV_H=GV_H GV_L=GV_L GW_H=GW_H GW_L=GW_L PWM_UH=PWM_1P1 PWM_UL=PWM_1N1 PWM_VH=PWM_2P1 PWM_VL=PWM_2N1 PWM_WH=PWM_3P1 PWM_WL=PWM_3N1 SH_U=OUT1 SH_V=OUT2 SH_W=OUT3 VDD=VBAT
U_Motors/U_Half Bridge Driver_2: designators end in _2; ports GND=GND GU_H=GU_H GU_L=GU_L GV_H=GV_H GV_L=GV_L GW_H=GU_H2 GW_L=GU_L2 PWM_UH=PWM_3P2 PWM_UL=PWM_3N2 PWM_VH=PWM_2P2 PWM_VL=PWM_2N2 PWM_WH=PWM_1P2 PWM_WL=PWM_1N2 SH_U=OUT3 SH_V=OUT2 SH_W=OUT1 VDD=VBAT
U_Motors/U_Half Bridge Driver_3: designators end in _3; ports GND=GND GU_H=GU_H GU_L=GU_L GV_H=GV_H GV_L=GV_L GW_H=GW_H GW_L=GW_L PWM_UH=PWM_1P3 PWM_UL=PWM_1N3 PWM_VH=PWM_2P3 PWM_VL=PWM_2N3 PWM_WH=PWM_3P3 PWM_WL=PWM_3N3 SH_U=OUT1 SH_V=OUT2 SH_W=OUT3 VDD=VBAT
U_Motors/U_Half Bridge Driver_4: designators end in _4; ports GND=GND GU_H=GU_H GU_L=GU_L GV_H=GV_H GV_L=GV_L GW_H=GU_H4 GW_L=GU_L4 PWM_UH=PWM_3P4 PWM_UL=PWM_3N4 PWM_VH=PWM_2P4 PWM_VL=PWM_2N4 PWM_WH=PWM_1P4 PWM_WL=PWM_1N4 SH_U=OUT3 SH_V=OUT2 SH_W=OUT1 VDD=VBAT

### Library data of the parts
C1-C3 = C0402C104K4RACAUTO: CAP CER 0.1UF 16V X7R 0402; manufacturer: KEMET; Tolerance: ±10%; Part Number: C0402C104K4RACAUTO; Value: 0.1 µF; Applications: Automotive, Bypass, Decoupling; Capacitance: 0.1 µF; componentlink1description: Datasheet; componentlink1url: https://api.kemet.com/component-edge/download/specsheet/C0402C104K4RACAUTO.pdf; componentlink2description: DigiKey Link; componentlink2url: https://www.digikey.com/en/products/detail/kemet/C0402C104K4RACAUTO/3314827; Device Package: 0402 (1005 Metric); lastupdated: 8/14/2022 9:05:51 PM; Lifecycle Status: Active; Minimum Order: 1; Mounting Type: Surface Mount, MLCC; Operating Temperature: -55°C ~ 125°C; Package / Case: 0402 (1005 Metric); packaging: TapeAndReel; partid: 3024; Part Status: Active; price: 0.01; Ratings: AEC-Q200; series: SMD Auto X7R; Size / Dimension: 0.039" L x 0.020" W (1.00mm x 0.50mm); Supplier 1: DigiKey; Supplier Part Number 1: 399-6828-1-ND; Temperature Coefficient: X7R; Thickness (Max): 0.022" (0.55mm); Voltage - Rated: 16V
D1-D3 = Diode: DFN1608D-2 (SOD1608); Manufacturer: Cree; ComponentLink2Description: Datasheet; Temperature: -40°C to +100°C; Package: LED_3MM2X2MM8; Supplier 2: Mouser; Price: 0.203999996142; Supplier 1: Digi-Key; ComponentLink1URL: https://upverter.com/upn/revision/9d0b31f7b1982705/; Supplier Part Number 2: 941-CLV1LFKBC7673673; Supplier Part Number 1: CLV1L-FKB-CHMMQEHBB7673673-ND; ComponentLink1Description: Upverter; ComponentLink2URL: http://www.cree.com/~/media/Files/Cree/LED-Components-and-Modules/HB/Data-Sheets/CLV1L-FKB-1238.pdf; RoHS: TRUE; Mouser Part Number: 941-CLV1LFKBC7673673; Temperature Range High: +100°C; Digikey Description: DIODE LED RGB DIFFUSED 4LCC SMD; Digikey Part Number: CLV1L-FKB-CHMMQEHBB7673673-ND; Lead Free: yes; Temperature Range Low: -40°C
R3 R13-R17 = RK73H1ETTP1432F: as R4 on sheet MOSFETs; Part Number: RK73H1ETTP1432F; Value: 1 Ohm; ComponentLink1Description: Datasheet; ComponentLink1URL: http://www.koaspeer.com/catimages/Products/RK73H/RK73H.pdf; ComponentLink2Description: DigiKey Link; ComponentLink2URL: https://www.digikey.com/en/products/detail/koa-speer-electronics-inc/RK73H1ETTP1432F/9844351; Composition: Thick Film; Device Package: 0402 (1005 Metric); Features: Automotive AEC-Q200, Moisture Resistant; Height - Seated (Max): 0.016" (0.40mm); LastUpdated: 8/14/2022 9:23:49 PM; Lifecycle Status: Active; Minimum Order: 1; Number of Terminations: 2; Operating Temperature: -55°C ~ 155°C; Package / Case: 0402 (1005 Metric); Packaging: CutTape; PartId: 10193; Part Status: Active; Price: 0.01; Ratings: AEC-Q200; Series: RK73H; Size / Dimension: 0.039" L x 0.020" W (1.00mm x 0.50mm); Supplier 1: DigiKey; Supplier Part Number 1: 2019-RK73H1ETTP1432FCT-ND; Supplier Device Package: 0402; Tolerance: ±1%
U1 = FD6288Q: 3 Phase Gate Driver 1.5-2.2A; MF: Texas Instruments; MP: UCC27282DRCR; Texas_Instruments-Purchase-URL: https://snapeda.com/shop?store=Texas+Instruments&id=3625400; Price: None; Availability: Warning; Package: VSON-10 Texas Instruments; SnapEDA_Link: https://www.snapeda.com/parts/UCC27282DRCR/Texas%20Instruments/view-part/3625400/?ref=snap; DigiKey-Purchase-URL: https://snapeda.com/shop?store=DigiKey&id=3625400; Value: *

## Sheet MCUs.SchDoc
size B; SheetNumber: 8; SheetTotal: 8
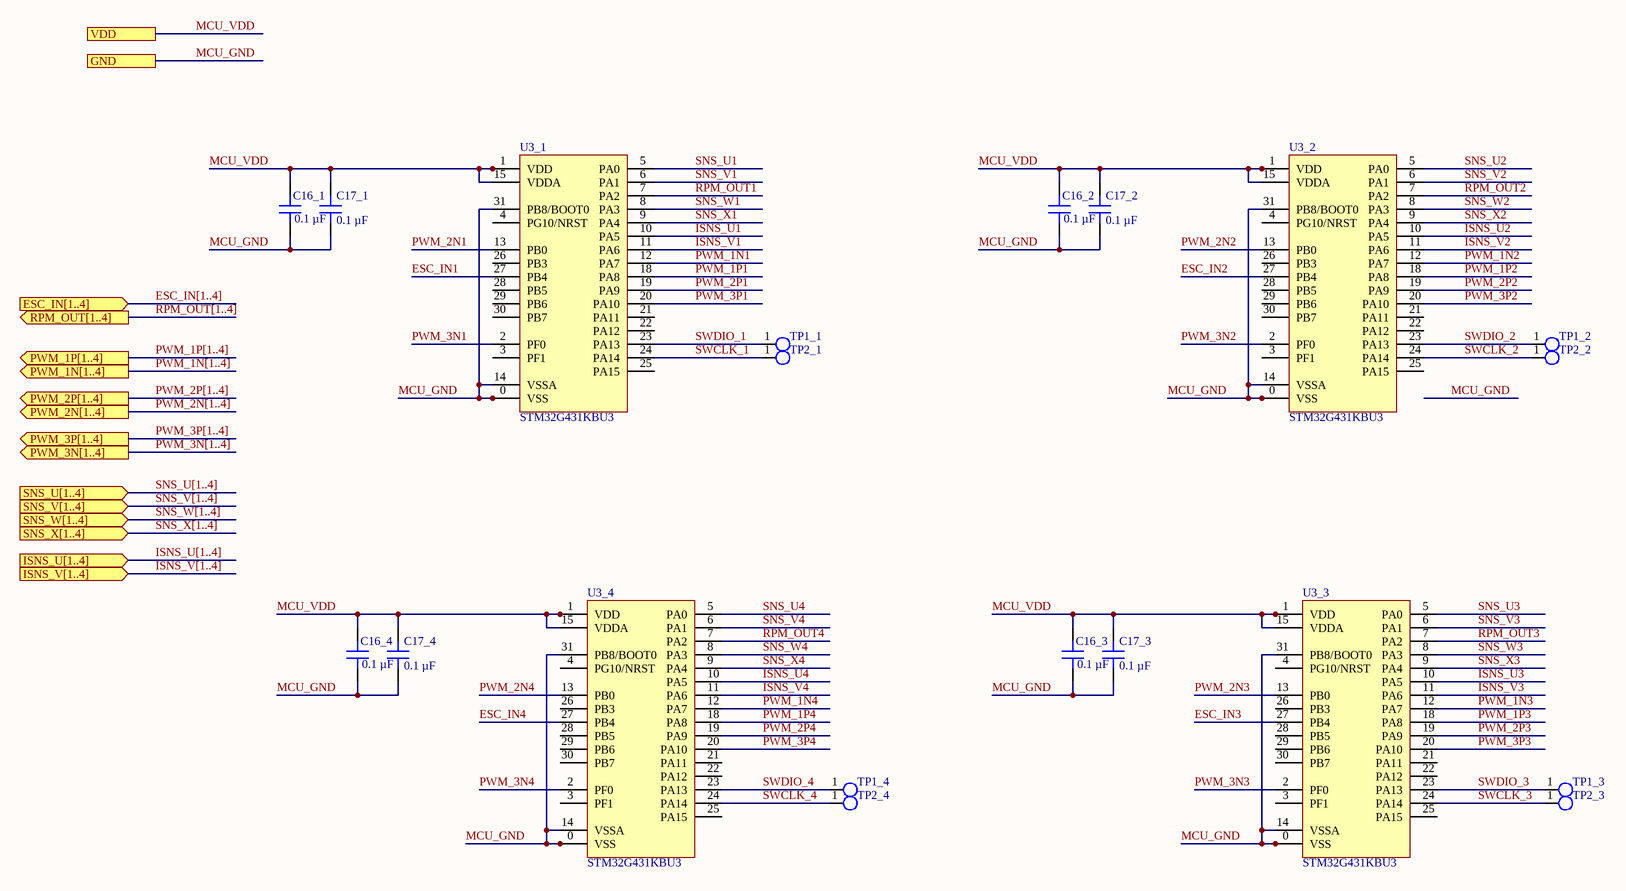
[diagram p6: MCUs.SchDoc]

### Parts
C16_1  0.1 µF  [CAP 0402_1005]
C16_2  0.1 µF  [CAP 0402_1005]
C16_3  0.1 µF  [CAP 0402_1005]
C16_4  0.1 µF  [CAP 0402_1005]
C17_1  0.1 µF  [CAP 0402_1005]
C17_2  0.1 µF  [CAP 0402_1005]
C17_3  0.1 µF  [CAP 0402_1005]
C17_4  0.1 µF  [CAP 0402_1005]
TP1_1  0.635mm  [TP  0.635mm]  (value not drawn)
TP1_2  0.635mm  [TP  0.635mm]  (value not drawn)
TP1_3  0.635mm  [TP  0.635mm]  (value not drawn)
TP1_4  0.635mm  [TP  0.635mm]  (value not drawn)
TP2_1  0.635mm  [TP  0.635mm]  (value not drawn)
TP2_2  0.635mm  [TP  0.635mm]  (value not drawn)
TP2_3  0.635mm  [TP  0.635mm]  (value not drawn)
TP2_4  0.635mm  [TP  0.635mm]  (value not drawn)
U3_1  STM32G431KBU3  [QFN50P400X400X60-32N]
U3_2  STM32G431KBU3  [QFN50P400X400X60-32N]
U3_3  STM32G431KBU3  [QFN50P400X400X60-32N]
U3_4  STM32G431KBU3  [QFN50P400X400X60-32N]

### Ports
ESC_IN[1..4] (in), GND, ISNS_U[1..4] (in), ISNS_V[1..4] (in), PWM_1N[1..4] (out), PWM_1P[1..4] (out), PWM_2N[1..4] (out), PWM_2P[1..4] (out), PWM_3N[1..4] (out), PWM_3P[1..4] (out), RPM_OUT[1..4] (out), SNS_U[1..4] (in), SNS_V[1..4] (in), SNS_W[1..4] (in), SNS_X[1..4] (in), VDD

### Nets
MCU_GND: C16_1.1 C16_2.1 C16_3.1 C16_4.1 C17_1.1 C17_2.1 C17_3.1 C17_4.1 U3_1.0(VSS) U3_1.14(VSSA) U3_1.16(VSS) U3_1.31(PB8/BOOT0) U3_1.32(VSS) U3_2.0(VSS) U3_2.14(VSSA) U3_2.16(VSS) U3_2.31(PB8/BOOT0) U3_2.32(VSS) U3_3.0(VSS) U3_3.14(VSSA) U3_3.16(VSS) U3_3.31(PB8/BOOT0) U3_3.32(VSS) U3_4.0(VSS) U3_4.14(VSSA) U3_4.16(VSS) U3_4.31(PB8/BOOT0) U3_4.32(VSS) ; port GND  [project net GND]
MCU_VDD: C16_1.2 C16_2.2 C16_3.2 C16_4.2 C17_1.2 C17_2.2 C17_3.2 C17_4.2 U3_1.1(VDD) U3_1.15(VDDA) U3_1.17(VDD) U3_2.1(VDD) U3_2.15(VDDA) U3_2.17(VDD) U3_3.1(VDD) U3_3.15(VDDA) U3_3.17(VDD) U3_4.1(VDD) U3_4.15(VDDA) U3_4.17(VDD) ; port VDD  [project net 3V3]
ESC_IN1: U3_1.27(PB4)  [project net ESC1]
ESC_IN2: U3_2.27(PB4)  [project net ESC2]
ESC_IN3: U3_3.27(PB4)  [project net ESC3]
ESC_IN4: U3_4.27(PB4)  [project net ESC4]
ISNS_U1: U3_1.10(PA5)
ISNS_U2: U3_2.10(PA5)
ISNS_U3: U3_3.10(PA5)
ISNS_U4: U3_4.10(PA5)
ISNS_V1: U3_1.11(PA6)
ISNS_V2: U3_2.11(PA6)
ISNS_V3: U3_3.11(PA6)
ISNS_V4: U3_4.11(PA6)
PWM_1N1: U3_1.12(PA7)
PWM_1N2: U3_2.12(PA7)
PWM_1N3: U3_3.12(PA7)
PWM_1N4: U3_4.12(PA7)
PWM_1P1: U3_1.18(PA8)
PWM_1P2: U3_2.18(PA8)
PWM_1P3: U3_3.18(PA8)
PWM_1P4: U3_4.18(PA8)
PWM_2N1: U3_1.13(PB0)
PWM_2N2: U3_2.13(PB0)
PWM_2N3: U3_3.13(PB0)
PWM_2N4: U3_4.13(PB0)
PWM_2P1: U3_1.19(PA9)
PWM_2P2: U3_2.19(PA9)
PWM_2P3: U3_3.19(PA9)
PWM_2P4: U3_4.19(PA9)
PWM_3N1: U3_1.2(PF0)
PWM_3N2: U3_2.2(PF0)
PWM_3N3: U3_3.2(PF0)
PWM_3N4: U3_4.2(PF0)
PWM_3P1: U3_1.20(PA10)
PWM_3P2: U3_2.20(PA10)
PWM_3P3: U3_3.20(PA10)
PWM_3P4: U3_4.20(PA10)
RPM_OUT1: U3_1.7(PA2)  [project net RPM1]
RPM_OUT2: U3_2.7(PA2)  [project net RPM2]
RPM_OUT3: U3_3.7(PA2)  [project net RPM3]
RPM_OUT4: U3_4.7(PA2)  [project net RPM4]
SNS_U1: U3_1.5(PA0)  [project net SNS_U]
SNS_U2: U3_2.5(PA0)  [project net SNS_U]
SNS_U3: U3_3.5(PA0)  [project net SNS_U]
SNS_U4: U3_4.5(PA0)  [project net SNS_U]
SNS_V1: U3_1.6(PA1)  [project net SNS_V]
SNS_V2: U3_2.6(PA1)  [project net SNS_V]
SNS_V3: U3_3.6(PA1)  [project net SNS_V]
SNS_V4: U3_4.6(PA1)  [project net SNS_V]
SNS_W1: U3_1.8(PA3)  [project net SNS_W]
SNS_W2: U3_2.8(PA3)  [project net SNS_W]
SNS_W3: U3_3.8(PA3)  [project net SNS_W]
SNS_W4: U3_4.8(PA3)  [project net SNS_W]
SNS_X1: U3_1.9(PA4)  [project net SNS_X]
SNS_X2: U3_2.9(PA4)  [project net SNS_X]
SNS_X3: U3_3.9(PA4)  [project net SNS_X]
SNS_X4: U3_4.9(PA4)  [project net SNS_X]
SWCLK_1: TP2_1.1(TP) U3_1.24(PA14)
SWCLK_2: TP2_2.1(TP) U3_2.24(PA14)
SWCLK_3: TP2_3.1(TP) U3_3.24(PA14)
SWCLK_4: TP2_4.1(TP) U3_4.24(PA14)
SWDIO_1: TP1_1.1(TP) U3_1.23(PA13)
SWDIO_2: TP1_2.1(TP) U3_2.23(PA13)
SWDIO_3: TP1_3.1(TP) U3_3.23(PA13)
SWDIO_4: TP1_4.1(TP) U3_4.23(PA13)

Not connected (* = marked no-connect by the designer): U3_1 3(PF1) 4(PG10/NRST) 21(PA11) 22(PA12) 25(PA15) 26(PB3) 28(PB5) 29(PB6) 30(PB7); U3_2 3(PF1) 4(PG10/NRST) 21(PA11) 22(PA12) 25(PA15) 26(PB3) 28(PB5) 29(PB6) 30(PB7); U3_3 3(PF1) 4(PG10/NRST) 21(PA11) 22(PA12) 25(PA15) 26(PB3) 28(PB5) 29(PB6) 30(PB7); U3_4 3(PF1) 4(PG10/NRST) 21(PA11) 22(PA12) 25(PA15) 26(PB3) 28(PB5) 29(PB6) 30(PB7)

### Buses and harness runs
bus ESC_IN[1..4] = port ESC_IN[1..4]
bus ISNS_U[1..4] = port ISNS_U[1..4]
bus ISNS_V[1..4] = port ISNS_V[1..4]
bus PWM_1N[1..4] = port PWM_1N[1..4]
bus PWM_1P[1..4] = port PWM_1P[1..4]
bus PWM_2N[1..4] = port PWM_2N[1..4]
bus PWM_2P[1..4] = port PWM_2P[1..4]
bus PWM_3N[1..4] = port PWM_3N[1..4]
bus PWM_3P[1..4] = port PWM_3P[1..4]
bus RPM_OUT[1..4] = port RPM_OUT[1..4]
bus SNS_U[1..4] = port SNS_U[1..4]
bus SNS_V[1..4] = port SNS_V[1..4]
bus SNS_W[1..4] = port SNS_W[1..4]
bus SNS_X[1..4] = port SNS_X[1..4]

### Library data of the parts
C16_1-C16_4 C17_1-C17_4 = C0402C104K4RACAUTO: as C1 on sheet Half_Bridge_Driver; Part Number: C0402C104K4RACAUTO; Value: 0.1 µF; Applications: Automotive, Bypass, Decoupling; Capacitance: 0.1 µF; componentlink1description: Datasheet; componentlink1url: https://api.kemet.com/component-edge/download/specsheet/C0402C104K4RACAUTO.pdf; componentlink2description: DigiKey Link; componentlink2url: https://www.digikey.com/en/products/detail/kemet/C0402C104K4RACAUTO/3314827; Device Package: 0402 (1005 Metric); lastupdated: 8/14/2022 9:05:51 PM; Lifecycle Status: Active; Minimum Order: 1; Mounting Type: Surface Mount, MLCC; Operating Temperature: -55°C ~ 125°C; Package / Case: 0402 (1005 Metric); packaging: TapeAndReel; partid: 3024; Part Status: Active; price: 0.01; Ratings: AEC-Q200; series: SMD Auto X7R; Size / Dimension: 0.039" L x 0.020" W (1.00mm x 0.50mm); Supplier 1: DigiKey; Supplier Part Number 1: 399-6828-1-ND; Temperature Coefficient: X7R; Thickness (Max): 0.022" (0.55mm); Voltage - Rated: 16V
TP1_1-TP1_4 TP2_1-TP2_4 = TP 0.635mm: Test point
U3_1-U3_4 = STM32G431KBU3: MCU UFQFPN-32

## Nets that join several sheets
3V3: 3V3_LDO (C8.1 C9.2 U1.5), MCUs (20 pins)
5V: 5V_buck (C12.2 C13.2 L1.2 U2.1), 3V3_LDO (C6.2 C7.1 R2.2 U1.1)
GND: Top (26 pins), 5V_buck (5 pins), 3V3_LDO (5 pins), U_Motors/U_MOSFETs1 (8 pins), U_Motors/U_MOSFETs2 (8 pins), U_Motors/U_MOSFETs3 (8 pins), U_Motors/U_MOSFETs4 (8 pins), U_Motors/U_Half Bridge Driver_1 (U1_1.6 U1_1.25), U_Motors/U_Half Bridge Driver_2 (U1_2.6 U1_2.25), U_Motors/U_Half Bridge Driver_3 (U1_3.6 U1_3.25), U_Motors/U_Half Bridge Driver_4 (U1_4.6 U1_4.25), MCUs (28 pins)
VBAT: Top (26 pins), 5V_buck (C14.2 C15.1 U2.2 U2.3), U_Motors/U_MOSFETs1 (12 pins), U_Motors/U_MOSFETs2 (12 pins), U_Motors/U_MOSFETs3 (12 pins), U_Motors/U_MOSFETs4 (12 pins), U_Motors/U_Half Bridge Driver_1 (D1_1.2 D2_1.2 D3_1.2 U1_1.4), U_Motors/U_Half Bridge Driver_2 (D1_2.2 D2_2.2 D3_2.2 U1_2.4), U_Motors/U_Half Bridge Driver_3 (D1_3.2 D2_3.2 D3_3.2 U1_3.4), U_Motors/U_Half Bridge Driver_4 (D1_4.2 D2_4.2 D3_4.2 U1_4.4)
ESC1: Top (J1.3), MCUs (U3_1.27)
ESC2: Top (J1.5), MCUs (U3_2.27)
ESC3: Top (J2.3), MCUs (U3_3.27)
ESC4: Top (J2.5), MCUs (U3_4.27)
GU_H: U_Motors/U_MOSFETs1 (Q1_1.4), U_Motors/U_Half Bridge Driver_1 (R3_1.2)
GU_H: U_Motors/U_MOSFETs2 (Q3_2.4), U_Motors/U_Half Bridge Driver_2 (R3_2.2)
GU_H: U_Motors/U_MOSFETs3 (Q1_3.4), U_Motors/U_Half Bridge Driver_3 (R3_3.2)
GU_H: U_Motors/U_MOSFETs4 (Q3_4.4), U_Motors/U_Half Bridge Driver_4 (R3_4.2)
GU_H2: U_Motors/U_MOSFETs2 (Q1_2.4), U_Motors/U_Half Bridge Driver_2 (R16_2.2)
GU_H4: U_Motors/U_MOSFETs4 (Q1_4.4), U_Motors/U_Half Bridge Driver_4 (R16_4.2)
GU_L: U_Motors/U_MOSFETs1 (Q4_1.4), U_Motors/U_Half Bridge Driver_1 (R13_1.2)
GU_L: U_Motors/U_MOSFETs2 (Q6_2.4), U_Motors/U_Half Bridge Driver_2 (R13_2.2)
GU_L: U_Motors/U_MOSFETs3 (Q4_3.4), U_Motors/U_Half Bridge Driver_3 (R13_3.2)
GU_L: U_Motors/U_MOSFETs4 (Q6_4.4), U_Motors/U_Half Bridge Driver_4 (R13_4.2)
GU_L2: U_Motors/U_MOSFETs2 (Q4_2.4), U_Motors/U_Half Bridge Driver_2 (R17_2.2)
GU_L4: U_Motors/U_MOSFETs4 (Q4_4.4), U_Motors/U_Half Bridge Driver_4 (R17_4.2)
GV_H: U_Motors/U_MOSFETs1 (Q2_1.4), U_Motors/U_Half Bridge Driver_1 (R14_1.2)
GV_H: U_Motors/U_MOSFETs2 (Q2_2.4), U_Motors/U_Half Bridge Driver_2 (R14_2.2)
GV_H: U_Motors/U_MOSFETs3 (Q2_3.4), U_Motors/U_Half Bridge Driver_3 (R14_3.2)
GV_H: U_Motors/U_MOSFETs4 (Q2_4.4), U_Motors/U_Half Bridge Driver_4 (R14_4.2)
GV_L: U_Motors/U_MOSFETs1 (Q5_1.4), U_Motors/U_Half Bridge Driver_1 (R15_1.2)
GV_L: U_Motors/U_MOSFETs2 (Q5_2.4), U_Motors/U_Half Bridge Driver_2 (R15_2.2)
GV_L: U_Motors/U_MOSFETs3 (Q5_3.4), U_Motors/U_Half Bridge Driver_3 (R15_3.2)
GV_L: U_Motors/U_MOSFETs4 (Q5_4.4), U_Motors/U_Half Bridge Driver_4 (R15_4.2)
GW_H: U_Motors/U_MOSFETs1 (Q3_1.4), U_Motors/U_Half Bridge Driver_1 (R16_1.2)
GW_H: U_Motors/U_MOSFETs3 (Q3_3.4), U_Motors/U_Half Bridge Driver_3 (R16_3.2)
GW_L: U_Motors/U_MOSFETs1 (Q6_1.4), U_Motors/U_Half Bridge Driver_1 (R17_1.2)
GW_L: U_Motors/U_MOSFETs3 (Q6_3.4), U_Motors/U_Half Bridge Driver_3 (R17_3.2)
OUT1: U_Motors/U_MOSFETs1 (8 pins), U_Motors/U_Half Bridge Driver_1 (C3_1.2 U1_1.18)
OUT1: U_Motors/U_MOSFETs2 (8 pins), U_Motors/U_Half Bridge Driver_2 (C1_2.2 U1_2.12)
OUT1: U_Motors/U_MOSFETs3 (8 pins), U_Motors/U_Half Bridge Driver_3 (C3_3.2 U1_3.18)
OUT1: U_Motors/U_MOSFETs4 (8 pins), U_Motors/U_Half Bridge Driver_4 (C1_4.2 U1_4.12)
OUT2: U_Motors/U_MOSFETs1 (8 pins), U_Motors/U_Half Bridge Driver_1 (C2_1.2 U1_1.15)
OUT2: U_Motors/U_MOSFETs2 (8 pins), U_Motors/U_Half Bridge Driver_2 (C2_2.2 U1_2.15)
OUT2: U_Motors/U_MOSFETs3 (8 pins), U_Motors/U_Half Bridge Driver_3 (C2_3.2 U1_3.15)
OUT2: U_Motors/U_MOSFETs4 (8 pins), U_Motors/U_Half Bridge Driver_4 (C2_4.2 U1_4.15)
OUT3: U_Motors/U_MOSFETs1 (8 pins), U_Motors/U_Half Bridge Driver_1 (C1_1.2 U1_1.12)
OUT3: U_Motors/U_MOSFETs2 (8 pins), U_Motors/U_Half Bridge Driver_2 (C3_2.2 U1_2.18)
OUT3: U_Motors/U_MOSFETs3 (8 pins), U_Motors/U_Half Bridge Driver_3 (C1_3.2 U1_3.12)
OUT3: U_Motors/U_MOSFETs4 (8 pins), U_Motors/U_Half Bridge Driver_4 (C3_4.2 U1_4.18)
PWM_1N1: U_Motors/U_Half Bridge Driver_1 (U1_1.1), MCUs (U3_1.12)
PWM_1N2: U_Motors/U_Half Bridge Driver_2 (U1_2.3), MCUs (U3_2.12)
PWM_1N3: U_Motors/U_Half Bridge Driver_3 (U1_3.1), MCUs (U3_3.12)
PWM_1N4: U_Motors/U_Half Bridge Driver_4 (U1_4.3), MCUs (U3_4.12)
PWM_1P1: U_Motors/U_Half Bridge Driver_1 (U1_1.22), MCUs (U3_1.18)
PWM_1P2: U_Motors/U_Half Bridge Driver_2 (U1_2.24), MCUs (U3_2.18)
PWM_1P3: U_Motors/U_Half Bridge Driver_3 (U1_3.22), MCUs (U3_3.18)
PWM_1P4: U_Motors/U_Half Bridge Driver_4 (U1_4.24), MCUs (U3_4.18)
PWM_2N1: U_Motors/U_Half Bridge Driver_1 (U1_1.2), MCUs (U3_1.13)
PWM_2N2: U_Motors/U_Half Bridge Driver_2 (U1_2.2), MCUs (U3_2.13)
PWM_2N3: U_Motors/U_Half Bridge Driver_3 (U1_3.2), MCUs (U3_3.13)
PWM_2N4: U_Motors/U_Half Bridge Driver_4 (U1_4.2), MCUs (U3_4.13)
PWM_2P1: U_Motors/U_Half Bridge Driver_1 (U1_1.23), MCUs (U3_1.19)
PWM_2P2: U_Motors/U_Half Bridge Driver_2 (U1_2.23), MCUs (U3_2.19)
PWM_2P3: U_Motors/U_Half Bridge Driver_3 (U1_3.23), MCUs (U3_3.19)
PWM_2P4: U_Motors/U_Half Bridge Driver_4 (U1_4.23), MCUs (U3_4.19)
PWM_3N1: U_Motors/U_Half Bridge Driver_1 (U1_1.3), MCUs (U3_1.2)
PWM_3N2: U_Motors/U_Half Bridge Driver_2 (U1_2.1), MCUs (U3_2.2)
PWM_3N3: U_Motors/U_Half Bridge Driver_3 (U1_3.3), MCUs (U3_3.2)
PWM_3N4: U_Motors/U_Half Bridge Driver_4 (U1_4.1), MCUs (U3_4.2)
PWM_3P1: U_Motors/U_Half Bridge Driver_1 (U1_1.24), MCUs (U3_1.20)
PWM_3P2: U_Motors/U_Half Bridge Driver_2 (U1_2.22), MCUs (U3_2.20)
PWM_3P3: U_Motors/U_Half Bridge Driver_3 (U1_3.24), MCUs (U3_3.20)
PWM_3P4: U_Motors/U_Half Bridge Driver_4 (U1_4.22), MCUs (U3_4.20)
RPM1: Top (J1.4), MCUs (U3_1.7)
RPM2: Top (J1.6), MCUs (U3_2.7)
RPM3: Top (J2.4), MCUs (U3_3.7)
RPM4: Top (J2.6), MCUs (U3_4.7)
SNS_U: U_Motors/U_MOSFETs1 (R4_1.2 R5_1.1 R10_1.2), MCUs (U3_1.5)
SNS_U: U_Motors/U_MOSFETs2 (R4_2.2 R5_2.1 R10_2.2), MCUs (U3_2.5)
SNS_U: U_Motors/U_MOSFETs3 (R4_3.2 R5_3.1 R10_3.2), MCUs (U3_3.5)
SNS_U: U_Motors/U_MOSFETs4 (R4_4.2 R5_4.1 R10_4.2), MCUs (U3_4.5)
SNS_V: U_Motors/U_MOSFETs1 (R6_1.2 R7_1.1 R11_1.2), MCUs (U3_1.6)
SNS_V: U_Motors/U_MOSFETs2 (R6_2.2 R7_2.1 R11_2.2), MCUs (U3_2.6)
SNS_V: U_Motors/U_MOSFETs3 (R6_3.2 R7_3.1 R11_3.2), MCUs (U3_3.6)
SNS_V: U_Motors/U_MOSFETs4 (R6_4.2 R7_4.1 R11_4.2), MCUs (U3_4.6)
SNS_W: U_Motors/U_MOSFETs1 (R8_1.2 R9_1.1 R12_1.2), MCUs (U3_1.8)
SNS_W: U_Motors/U_MOSFETs2 (R8_2.2 R9_2.1 R12_2.2), MCUs (U3_2.8)
SNS_W: U_Motors/U_MOSFETs3 (R8_3.2 R9_3.1 R12_3.2), MCUs (U3_3.8)
SNS_W: U_Motors/U_MOSFETs4 (R8_4.2 R9_4.1 R12_4.2), MCUs (U3_4.8)
SNS_X: U_Motors/U_MOSFETs1 (R4_1.1 R6_1.1 R8_1.1), MCUs (U3_1.9)
SNS_X: U_Motors/U_MOSFETs2 (R4_2.1 R6_2.1 R8_2.1), MCUs (U3_2.9)
SNS_X: U_Motors/U_MOSFETs3 (R4_3.1 R6_3.1 R8_3.1), MCUs (U3_3.9)
SNS_X: U_Motors/U_MOSFETs4 (R4_4.1 R6_4.1 R8_4.1), MCUs (U3_4.9)

## Assembly variants
Main: all parts fitted